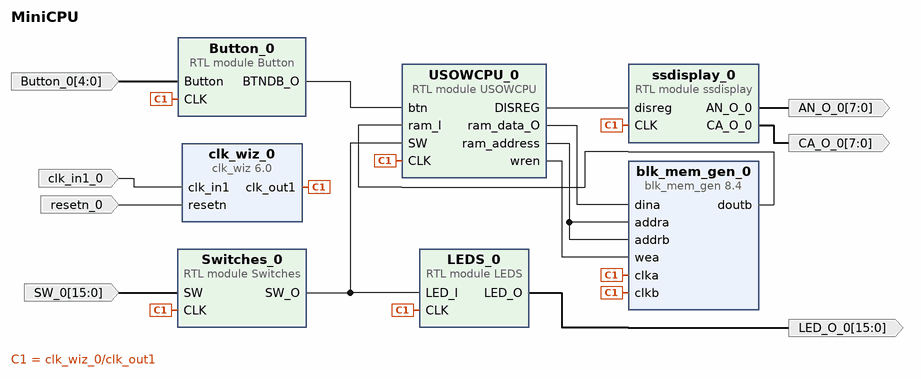
[diagram p0: block diagram of the top level]
# Vivado block design MiniCPU, xc7a100tcsg324-1, Vivado 2020.2
create_bd_design MiniCPU

create_bd_port -dir I -from 4 -to 0 Button_0
create_bd_port -dir I -from 15 -to 0 SW_0
create_bd_port -dir O -from 15 -to 0 LED_O_0
create_bd_port -dir I -type clk clk_in1_0
create_bd_port -dir O -from 7 -to 0 CA_O_0
create_bd_port -dir O -from 7 -to 0 AN_O_0
create_bd_port -dir I -type rst resetn_0

create_bd_cell -type module -reference Switches Switches_0
create_bd_cell -type module -reference LEDS LEDS_0
create_bd_cell -type ip -vlnv xilinx.com:ip:clk_wiz:6.0 clk_wiz_0
set_property -dict [list \
  CONFIG.CLKOUT1_DRIVES BUFG \
  CONFIG.CLKOUT2_DRIVES BUFG \
  CONFIG.CLKOUT2_JITTER 130.958 \
  CONFIG.CLKOUT2_PHASE_ERROR 98.575 \
  CONFIG.CLKOUT2_USED false \
  CONFIG.CLKOUT3_DRIVES BUFG \
  CONFIG.CLKOUT3_JITTER 130.958 \
  CONFIG.CLKOUT3_PHASE_ERROR 98.575 \
  CONFIG.CLKOUT3_USED false \
  CONFIG.CLKOUT4_DRIVES BUFG \
  CONFIG.CLKOUT5_DRIVES BUFG \
  CONFIG.CLKOUT6_DRIVES BUFG \
  CONFIG.CLKOUT7_DRIVES BUFG \
  CONFIG.CLK_IN1_BOARD_INTERFACE Custom \
  CONFIG.MMCM_CLKOUT1_DIVIDE 1 \
  CONFIG.MMCM_CLKOUT2_DIVIDE 1 \
  CONFIG.NUM_OUT_CLKS 1 \
  CONFIG.RESET_BOARD_INTERFACE Custom \
  CONFIG.RESET_PORT resetn \
  CONFIG.RESET_TYPE ACTIVE_LOW \
  CONFIG.SECONDARY_SOURCE Single_ended_clock_capable_pin \
  CONFIG.USE_LOCKED false \
  CONFIG.USE_PHASE_ALIGNMENT false \
] [get_bd_cells clk_wiz_0]
create_bd_cell -type module -reference ssdisplay ssdisplay_0
create_bd_cell -type module -reference Button Button_0
create_bd_cell -type ip -vlnv xilinx.com:ip:blk_mem_gen:8.4 blk_mem_gen_0
set_property -dict [list \
  CONFIG.Assume_Synchronous_Clk true \
  CONFIG.Disable_Collision_Warnings true \
  CONFIG.Disable_Out_of_Range_Warnings true \
  CONFIG.Enable_32bit_Address false \
  CONFIG.Enable_A Always_Enabled \
  CONFIG.Enable_B Always_Enabled \
  CONFIG.Memory_Type Simple_Dual_Port_RAM \
  CONFIG.Operating_Mode_A WRITE_FIRST \
  CONFIG.Port_B_Clock 100 \
  CONFIG.Port_B_Enable_Rate 100 \
  CONFIG.Read_Width_B 16 \
  CONFIG.Register_PortB_Output_of_Memory_Primitives false \
  CONFIG.Use_Byte_Write_Enable false \
  CONFIG.Write_Depth_A 65535 \
  CONFIG.Write_Width_A 16 \
  CONFIG.Write_Width_B 16 \
  CONFIG.use_bram_block Stand_Alone \
] [get_bd_cells blk_mem_gen_0]
create_bd_cell -type module -reference USOWCPU USOWCPU_0

# ---- connections ----

connect_bd_net [get_bd_pins clk_wiz_0/clk_out1] \
  [get_bd_pins LEDS_0/CLK] [get_bd_pins Switches_0/CLK] [get_bd_pins ssdisplay_0/CLK] [get_bd_pins Button_0/CLK] \
  [get_bd_pins blk_mem_gen_0/clkb] [get_bd_pins blk_mem_gen_0/clka] [get_bd_pins USOWCPU_0/CLK]
connect_bd_net -net Button_0_1 [get_bd_ports Button_0] [get_bd_pins Button_0/Button]
connect_bd_net -net SW_0_1 [get_bd_ports SW_0] [get_bd_pins Switches_0/SW]
connect_bd_net [get_bd_pins LEDS_0/LED_O] [get_bd_ports LED_O_0]
connect_bd_net [get_bd_pins Switches_0/SW_O] [get_bd_pins LEDS_0/LED_I] [get_bd_pins USOWCPU_0/SW]
connect_bd_net -net clk_in1_0_1 [get_bd_ports clk_in1_0] [get_bd_pins clk_wiz_0/clk_in1]
connect_bd_net [get_bd_pins ssdisplay_0/CA_O_0] [get_bd_ports CA_O_0]
connect_bd_net [get_bd_pins ssdisplay_0/AN_O_0] [get_bd_ports AN_O_0]
connect_bd_net -net USOWCPU_0_DISPLAYREG [get_bd_pins USOWCPU_0/DISREG] [get_bd_pins ssdisplay_0/disreg]
connect_bd_net [get_bd_pins Button_0/BTNDB_O] [get_bd_pins USOWCPU_0/btn]
connect_bd_net -net resetn_0_1 [get_bd_ports resetn_0] [get_bd_pins clk_wiz_0/resetn]
connect_bd_net [get_bd_pins USOWCPU_0/ram_data_O] [get_bd_pins blk_mem_gen_0/dina]
connect_bd_net [get_bd_pins USOWCPU_0/ram_address] [get_bd_pins blk_mem_gen_0/addra] [get_bd_pins blk_mem_gen_0/addrb]
connect_bd_net [get_bd_pins blk_mem_gen_0/doutb] [get_bd_pins USOWCPU_0/ram_I]
connect_bd_net [get_bd_pins USOWCPU_0/wren] [get_bd_pins blk_mem_gen_0/wea]

validate_bd_design
save_bd_design
